# Altium schematic sheet Diode.SchDoc
size A
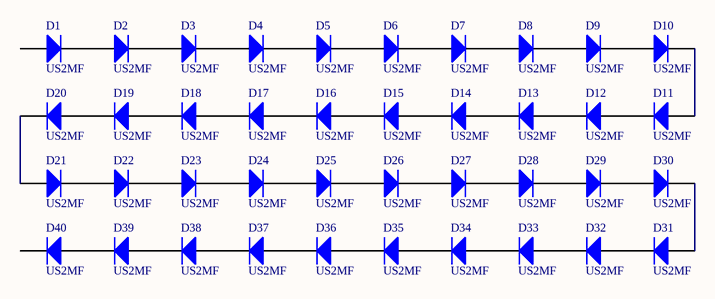
[diagram p0: Diode.SchDoc]

## Parts
D1  US2MF  [DO-214AC]
D2  US2MF  [DO-214AC]
D3  US2MF  [DO-214AC]
D4  US2MF  [DO-214AC]
D5  US2MF  [DO-214AC]
D6  US2MF  [DO-214AC]
D7  US2MF  [DO-214AC]
D8  US2MF  [DO-214AC]
D9  US2MF  [DO-214AC]
D10  US2MF  [DO-214AC]
D11  US2MF  [DO-214AC]
D12  US2MF  [DO-214AC]
D13  US2MF  [DO-214AC]
D14  US2MF  [DO-214AC]
D15  US2MF  [DO-214AC]
D16  US2MF  [DO-214AC]
D17  US2MF  [DO-214AC]
D18  US2MF  [DO-214AC]
D19  US2MF  [DO-214AC]
D20  US2MF  [DO-214AC]
D21  US2MF  [DO-214AC]
D22  US2MF  [DO-214AC]
D23  US2MF  [DO-214AC]
D24  US2MF  [DO-214AC]
D25  US2MF  [DO-214AC]
D26  US2MF  [DO-214AC]
D27  US2MF  [DO-214AC]
D28  US2MF  [DO-214AC]
D29  US2MF  [DO-214AC]
D30  US2MF  [DO-214AC]
D31  US2MF  [DO-214AC]
D32  US2MF  [DO-214AC]
D33  US2MF  [DO-214AC]
D34  US2MF  [DO-214AC]
D35  US2MF  [DO-214AC]
D36  US2MF  [DO-214AC]
D37  US2MF  [DO-214AC]
D38  US2MF  [DO-214AC]
D39  US2MF  [DO-214AC]
D40  US2MF  [DO-214AC]

## Nets
NetD1_1: D1.1(K) D2.2(A)
NetD2_1: D2.1(K) D3.2(A)
NetD3_1: D3.1(K) D4.2(A)
NetD4_1: D4.1(K) D5.2(A)
NetD5_1: D5.1(K) D6.2(A)
NetD6_1: D6.1(K) D7.2(A)
NetD7_1: D7.1(K) D8.2(A)
NetD8_1: D8.1(K) D9.2(A)
NetD9_1: D9.1(K) D10.2(A)
NetD10_1: D10.1(K) D11.2(A)
NetD11_1: D11.1(K) D12.2(A)
NetD12_1: D12.1(K) D13.2(A)
NetD13_1: D13.1(K) D14.2(A)
NetD14_1: D14.1(K) D15.2(A)
NetD15_1: D15.1(K) D16.2(A)
NetD16_1: D16.1(K) D17.2(A)
NetD17_1: D17.1(K) D18.2(A)
NetD18_1: D18.1(K) D19.2(A)
NetD19_1: D19.1(K) D20.2(A)
NetD20_1: D20.1(K) D21.2(A)
NetD21_1: D21.1(K) D22.2(A)
NetD22_1: D22.1(K) D23.2(A)
NetD23_1: D23.1(K) D24.2(A)
NetD24_1: D24.1(K) D25.2(A)
NetD25_1: D25.1(K) D26.2(A)
NetD26_1: D26.1(K) D27.2(A)
NetD27_1: D27.1(K) D28.2(A)
NetD28_1: D28.1(K) D29.2(A)
NetD29_1: D29.1(K) D30.2(A)
NetD30_1: D30.1(K) D31.2(A)
NetD31_1: D31.1(K) D32.2(A)
NetD32_1: D32.1(K) D33.2(A)
NetD33_1: D33.1(K) D34.2(A)
NetD34_1: D34.1(K) D35.2(A)
NetD35_1: D35.1(K) D36.2(A)
NetD36_1: D36.1(K) D37.2(A)
NetD37_1: D37.1(K) D38.2(A)
NetD38_1: D38.1(K) D39.2(A)
NetD39_1: D39.1(K) D40.2(A)

Not connected (* = marked no-connect by the designer): D1 2(A); D40 1(K)

## Library data of the parts
D1-D40 = US2MF: DIODE - HyperFast 1kV; Vrrm: 1000; If: 2A; Trr: 75ns; LCSC Part #: C108845; JLC Availability: Extended